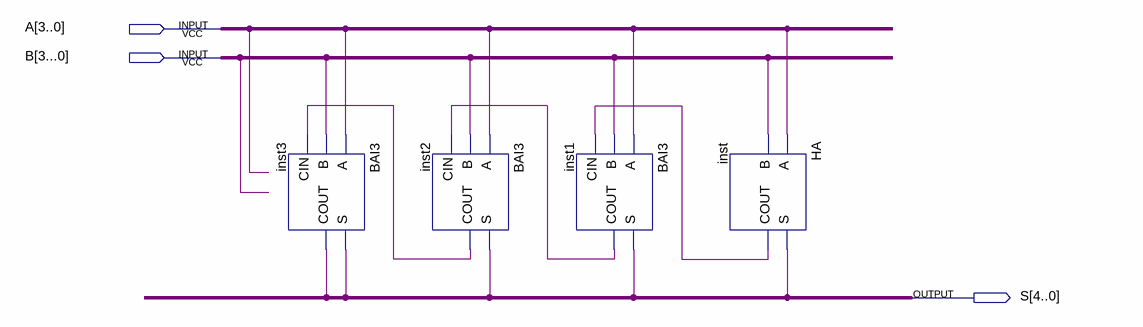
[diagram p0: schematic sheet]
// Quartus schematic BAI3_1.bdf as structural Verilog: 4 symbols, 3 pins
module BAI3_1 (
  input  [3:0] A,
  input  \B[3...0] ,
  output [4:0] S
);

  wire inst1_cout, inst1_s, inst2_cout, inst2_s, inst3_cout, inst3_s, inst_cout, inst_s, undriven,
       undriven_2, undriven_3, undriven_4;

  BAI3 inst3 (.A(undriven_4), .B(\B[3...0] ), .CIN(inst2_cout), .S(inst3_s), .COUT(inst3_cout));
  BAI3 inst2 (.A(undriven_3), .B(\B[3...0] ), .CIN(inst1_cout), .S(inst2_s), .COUT(inst2_cout));
  BAI3 inst1 (.A(undriven_2), .B(\B[3...0] ), .CIN(inst_cout), .S(inst1_s), .COUT(inst1_cout));
  HA inst (.A(undriven), .B(\B[3...0] ), .S(inst_s), .COUT(inst_cout));
endmodule
